# EAGLE design Bus_Isolator (EAGLE 6.5.0)
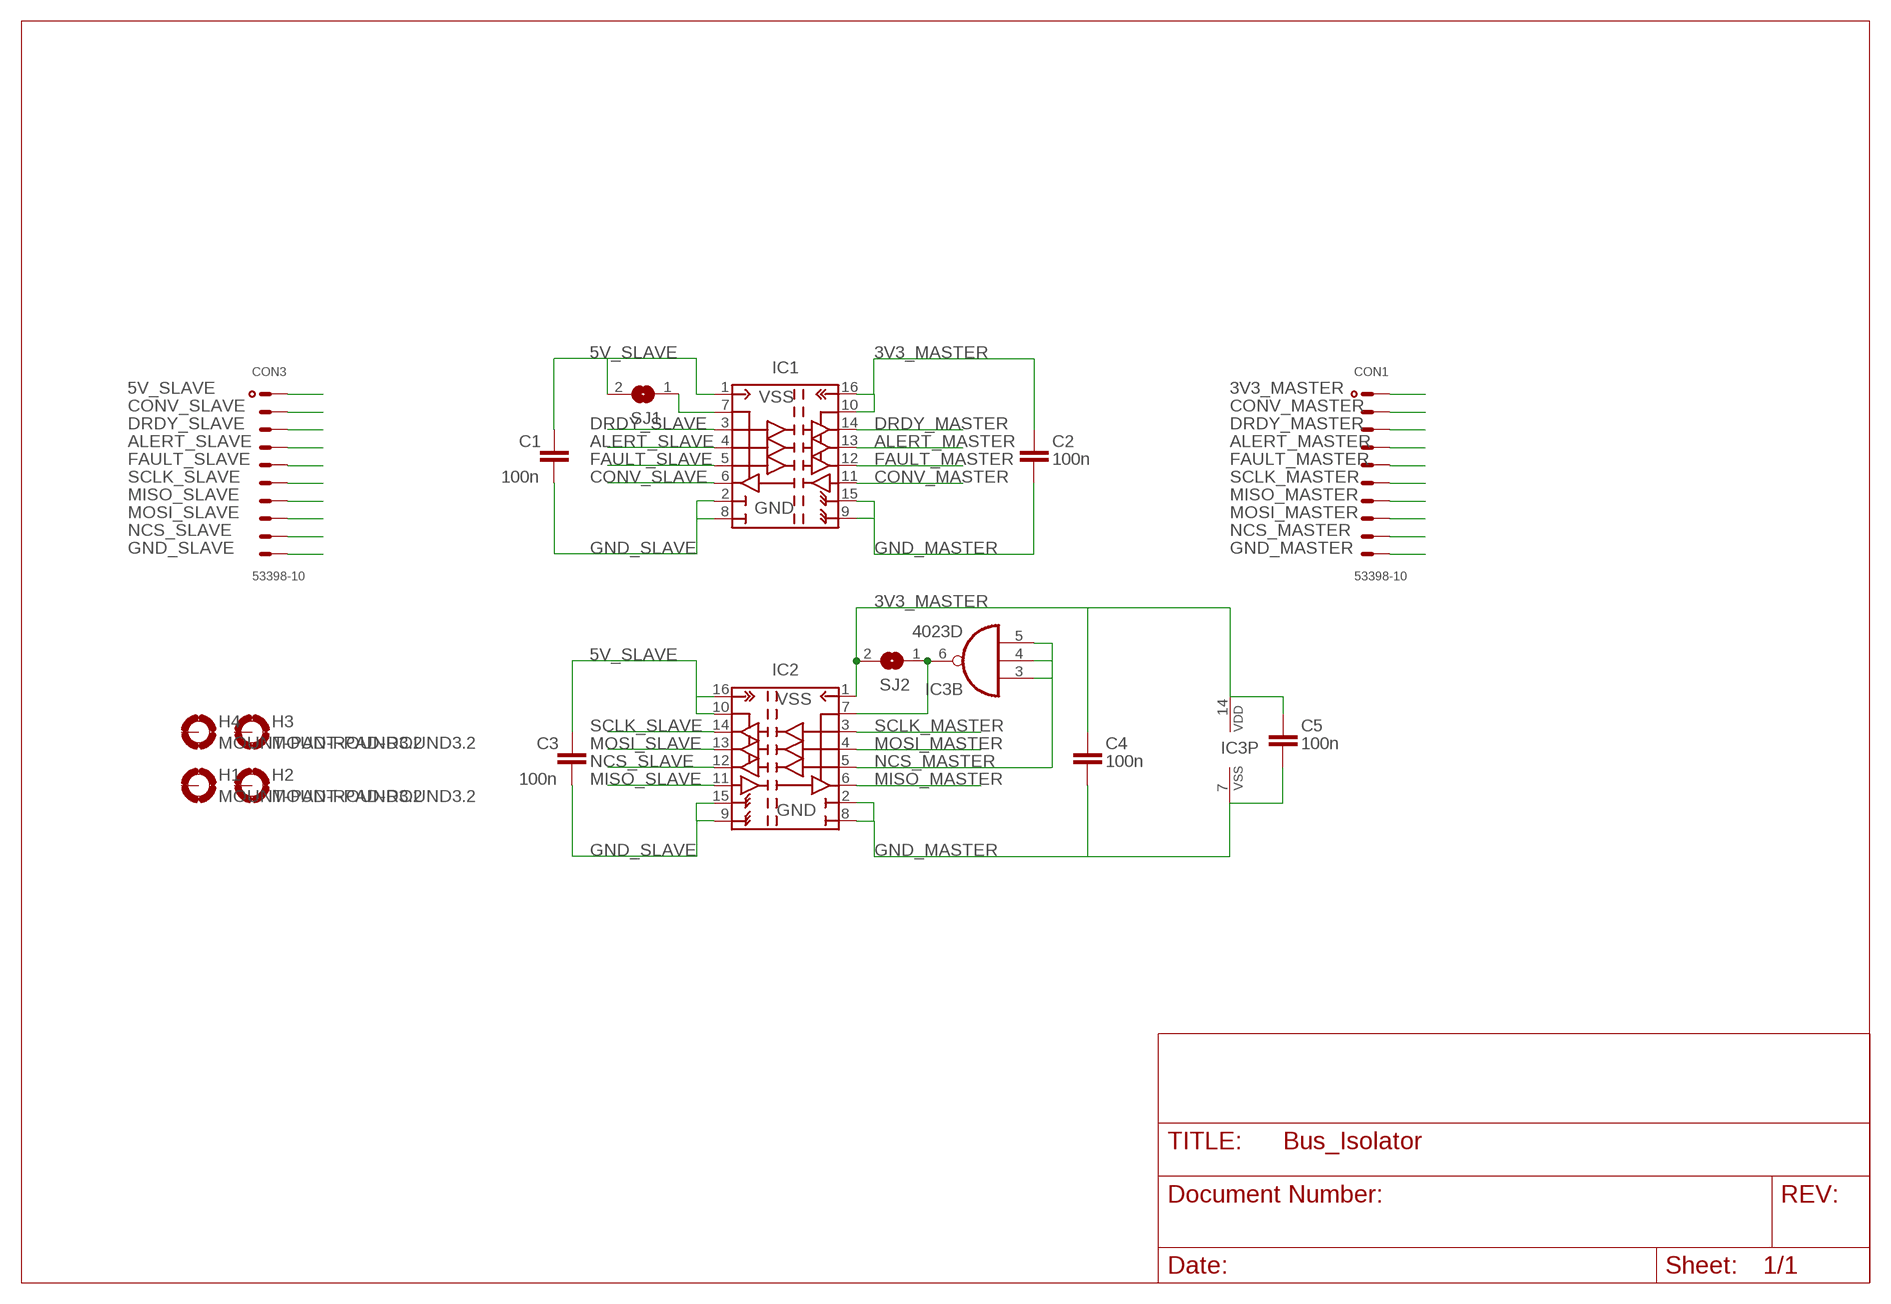
[diagram p0: schematic, sheet 1]

## Parts
C1  100n  CSTD  [C0805]
C2  100n  CSTD  [C0805]
C3  100n  CSTD  [C0805]
C4  100n  CSTD  [C0805]
C5  100n  CSTD  [C0805]
CON1  53398-10  [53398-10]
CON3  53398-10  [53398-10]
H1  MOUNT-PAD-ROUND3.2  [3,2-PAD]
H2  MOUNT-PAD-ROUND3.2  [3,2-PAD]
H3  MOUNT-PAD-ROUND3.2  [3,2-PAD]
H4  MOUNT-PAD-ROUND3.2  [3,2-PAD]
IC1  ISO7241  [R-PDSO-G16]
IC2  ISO7241  [R-PDSO-G16]
IC3  4023D  [SO14]
SJ1  SJ  [SJ]
SJ2  SJ  [SJ]

## Nets
3V3_MASTER: C2.2 C4.2 C5.2 CON1.1 IC1.10(EN2) IC1.16(VCC2) IC2.1(VCC1) IC3.14(P:VDD) SJ2.2
5V_SLAVE: C1.2 C3.2 CON3.1 IC1.1(VCC1) IC2.10(EN2) IC2.16(VCC2) SJ1.2
ALERT_MASTER: CON1.4 IC1.13(OUT_B)
ALERT_SLAVE: CON3.4 IC1.4(IN_B)
CONV_MASTER: CON1.2 IC1.11(IN_D)
CONV_SLAVE: CON3.2 IC1.6(OUT_D)
DRDY_MASTER: CON1.3 IC1.14(OUT_A)
DRDY_SLAVE: CON3.3 IC1.3(IN_A)
FAULT_MASTER: CON1.5 IC1.12(OUT_C)
FAULT_SLAVE: CON3.5 IC1.5(IN_C)
GND_MASTER: C2.1 C4.1 C5.1 CON1.10 IC1.9(GND22) IC1.15(GND21) IC2.2(GND11) IC2.8(GND12) IC3.7(P:VSS)
GND_SLAVE: C1.1 C3.1 CON3.10 IC1.2(GND11) IC1.8(GND12) IC2.9(GND22) IC2.15(GND21)
MISO_MASTER: CON1.7 IC2.6(OUT_D)
MISO_SLAVE: CON3.7 IC2.11(IN_D)
MOSI_MASTER: CON1.8 IC2.4(IN_B)
MOSI_SLAVE: CON3.8 IC2.13(OUT_B)
N$1: IC1.7(EN1) SJ1.1
N$2: IC2.7(EN1) IC3.6(B:O) SJ2.1
NCS_MASTER: CON1.9 IC2.5(IN_C) IC3.3(B:I0) IC3.4(B:I1) IC3.5(B:I2)
NCS_SLAVE: CON3.9 IC2.12(OUT_C)
SCLK_MASTER: CON1.6 IC2.3(IN_A)
SCLK_SLAVE: CON3.6 IC2.14(OUT_A)
Unconnected: H1.B3,2(MOUNT) H2.B3,2(MOUNT) H3.B3,2(MOUNT) H4.B3,2(MOUNT) IC3.1(A:I0) IC3.2(A:I1) IC3.8(A:I2) IC3.9(A:O) IC3.10(C:O) IC3.11(C:I0) IC3.12(C:I1) IC3.13(C:I2)

## Library data of the parts
C1-C5 = useful:C
CON1 CON3 = con-molex:53?-10: CONNECTOR wire to board 1.25 mm (.049 inch) pitch header
H1-H4 = holes:MOUNT-PAD-ROUND: MOUNTING PAD, round
IC1 IC2 = ti:ISO7241
IC3 = 40xx:4023: Triple 3-input NAND
SJ1 SJ2 = jumper:SJ: SMD solder JUMPER

## Board
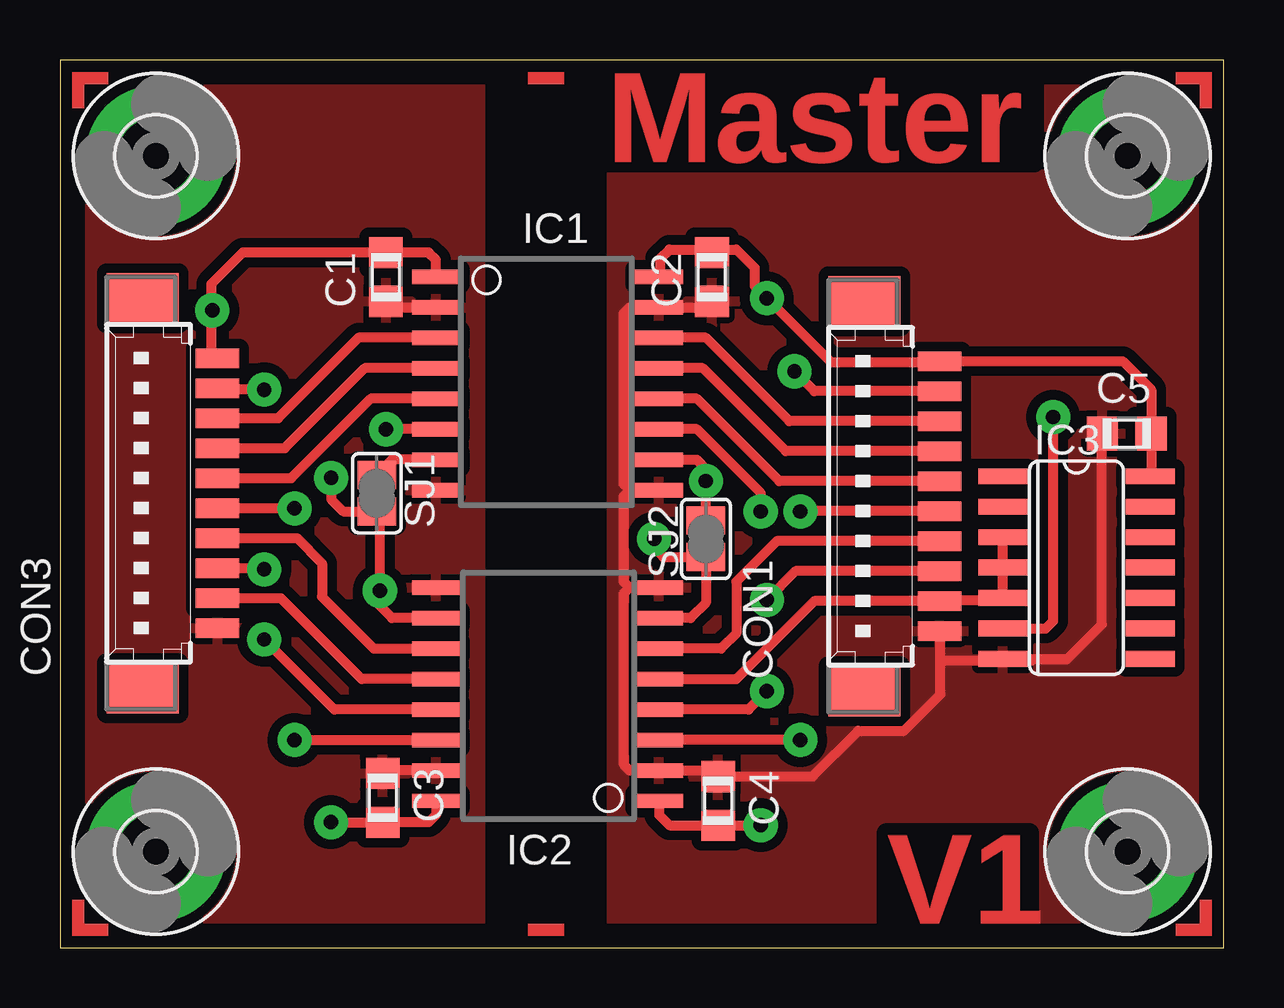
[diagram p1: board, top side]
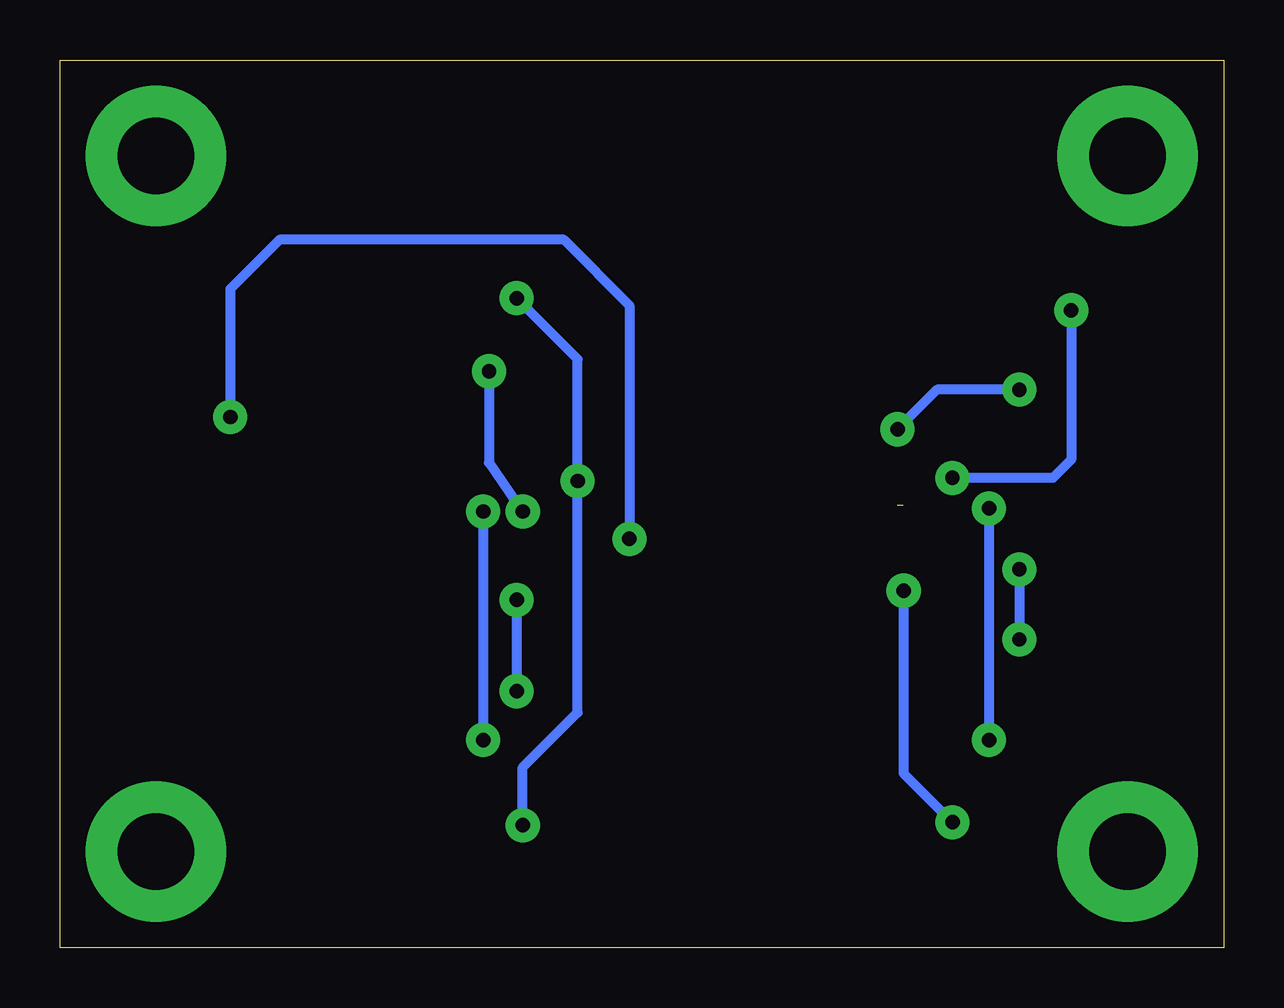
[diagram p2: board, bottom side, seen from below]

Size 48.5 x 37 mm. Coordinates in mm from the lower left corner, seen from the top.
Outline: 0,0 48.5,0 48.5,37 0,37 0,0
Copper layers (1*16): Top 0.035mm / dielectric 1.5mm / Bottom 0.035mm
Design rules "default": minimum track width 10mil, minimum drill 24mil, track to track 8mil, track to pad 8mil, pad to pad 8mil, via to via 8mil, smd to smd 8mil, copper to edge 40mil, drill to drill 8mil, minimum pad ring 10mil, minimum via ring 8mil, stop-mask expansion 4mil, vias tented up to drill 0mil, thermal gap 10mil

### Footprints (pad centres in the part's own frame; a part is rotated, then mirrored left to right if it is on the bottom)
C0805 = smd 1.3 x 1.4: 1 -1.016,0; 2 1.016,0
53398-10 = smd 0.8 x 1.8: 1 5.625,-2.5; 2 4.375,-2.5; 3 3.125,-2.5; 4 1.875,-2.5; 5 0.625,-2.5; 6 -0.625,-2.5; 7 -1.875,-2.5; 8 -3.125,-2.5; 9 -4.375,-2.5; 10 -5.625,-2.5 | smd 2.1 x 3: S1 8.125,0.625; S2 -8.125,0.625
3,2-PAD = drill 3.2 pad 5.842: B3,2 0,0
R-PDSO-G16 = smd 0.6 x 2: 1 -3.937,-4.649; 2 -2.667,-4.649; 3 -1.397,-4.649; 4 -0.127,-4.649; 5 1.143,-4.649; 6 2.413,-4.649; 7 3.683,-4.649; 8 4.953,-4.649; 9 4.953,4.651; 10 3.683,4.651; 11 2.413,4.651; 12 1.143,4.651; 13 -0.127,4.651; 14 -1.397,4.651; 15 -2.667,4.651; 16 -3.937,4.651
SO14 = smd 0.66 x 2.032: 1 -3.81,-3.073; 2 -2.54,-3.073; 3 -1.27,-3.073; 4 0,-3.073; 5 1.27,-3.073; 6 2.54,-3.073; 7 3.81,-3.073; 8 3.81,3.073; 9 2.54,3.073; 10 1.27,3.073; 11 0,3.073; 12 -1.27,3.073; 13 -2.54,3.073; 14 -3.81,3.073
SJ = smd 1.168 x 1.6: 1 -0.762,0; 2 0.762,0

### Placement (x,y rotation side)
C1  13.59,27.96 90 top
C2  27.18,27.96 90 top
C3  13.45,6.24 270 top
C4  27.43,6.11 270 top
C5  44.47,21.43 0 top
CON1  34.16,18.81 90 top
CON3  4.06,18.94 90 top
H1  4,4 0 top
H2  44.5,4 0 top
H3  4,33 0 top
H4  44.5,33 0 top
IC1  20.32,24.02 270 top
IC2  20.32,10.05 90 top
IC3  42.37,15.84 270 top
SJ1  13.21,18.94 270 top
SJ2  26.92,17.04 90 top

### Tracks (layer width: path | path; a pad name or v marks a point on that pad's centre or on a via)
3V3_MASTER  (via drill 0.6 pad 1.42)
  Top 0.406: 27.56,29.1 25.4,29.1 25.02,28.72 25.02,28 IC1.16 | 27.56,29.1 C2.2 | 27.56,29.1 28.19,29.1 28.96,28.34 28.96,27.58 v29.46,27.07 32.13,24.4 35.99,24.4 CON1.1 44.3,24.44 45.48,23.26 C5.2 45.48,19.88 IC3.14 | SJ2.2 v26.92,19.45 26.92,19.96 26.54,20.34 IC1.10 | IC2.1 24.97,5.53 25.4,5.1 C4.2 v29.21,5.1
  Bottom 0.406: v29.46,27.07 26.92,24.53 v26.92,19.45 26.92,9.8 29.21,7.51 v29.21,5.1
5V_SLAVE  (via drill 0.6 pad 1.42)  (1 unrouted)
  Top 0.406: 13.59,18.43 SJ1.2 11.81,18.18 11.3,18.69 v11.3,19.57 | 13.34,18.43 v13.34,14.88 13.34,14.24 13.84,13.73 IC2.10 | v11.29,5.22 C3.2 15.37,5.22 15.67,5.53 IC2.16 | IC1.1 15.67,28.67 15.37,28.97 C1.2 7.62,28.97 6.31,27.66 6.31,26.6 v6.35,26.56 6.31,26.52 6.31,24.82 CON3.1
  Bottom 0.406: v6.35,26.56 6.35,20.34 7.11,19.57 v11.3,19.57 | v13.34,14.88 13.34,7.26 v11.29,5.22
ALERT_MASTER
  Top 0.406: CON1.4 30.26,20.69 26.8,24.15 IC1.13
ALERT_SLAVE
  Top 0.406: CON3.4 9.37,20.81 12.7,24.15 IC1.4
CONV_MASTER  (via drill 0.6 pad 1.42)
  Top 0.406: CON1.2 31.45,23.19 v30.61,24.02 | v29.21,18.18 29.21,18.94 26.54,21.61 IC1.11
  Bottom 0.406: v30.61,24.02 30.61,20.22 v29.21,18.18
CONV_SLAVE  (via drill 0.6 pad 1.42)
  Top 0.406: v8.51,23.26 6.37,23.26 CON3.2 | IC1.6 v13.59,21.61
  Bottom 0.406: v8.51,23.26 11.94,23.26 v13.59,21.61
DRDY_MASTER
  Top 0.406: CON1.3 30.4,21.94 26.92,25.42 IC1.14
DRDY_SLAVE
  Top 0.406: CON3.3 9.09,22.06 12.45,25.42 IC1.3
FAULT_MASTER
  Top 0.406: CON1.5 29.98,19.44 26.54,22.88 IC1.12
FAULT_SLAVE
  Top 0.406: CON3.5 9.64,19.56 12.95,22.88 IC1.5
GND_MASTER
  Top 0.406: C2.1 26.92,26.69 IC1.15 23.75,26.69 23.5,26.43 23.5,19.32 23.75,19.07 | IC1.9 23.75,19.07 | 23.75,19.07 23.5,18.81 23.5,15.26 23.75,15 | IC2.8 23.75,15 | 23.75,15 23.5,14.75 23.5,7.64 23.75,7.38 IC2.2 27.18,7.38 C4.1 31.37,7.13 33.27,9.03 35.18,9.03 36.7,10.56 36.7,12.08 | 36.7,12.08 36.7,13.15 CON1.10 | 36.7,12.08 36.83,11.96 40.49,11.96 IC3.7 41.98,12.03 43.43,13.48 43.43,21.41 C5.1
  pour Top (isolate 0.406): 23,37.5 43.5,37.5 49.5,31.5 49.5,4.5 44.5,-0.5 23,-0.5
GND_SLAVE
  Top 0.406: IC1.2 13.84,26.69 C1.1 | IC2.15 13.58,7.38 C3.1
  pour Top (isolate 0.406): 4,37 17.5,37 17.5,-0.5 4.5,-0.5 -0.5,4 -0.5,32.5
MISO_MASTER
  Top 0.406: CON1.7 29.88,16.94 28.19,15.26 28.19,13.1 27.56,12.46 IC2.6
MISO_SLAVE
  Top 0.406: IC2.11 13.08,12.46 10.92,14.62 10.92,16.02 9.88,17.06 CON3.7
MOSI_MASTER  (via drill 0.6 pad 1.42)
  Top 0.406: CON1.8 30.66,15.69 v29.46,14.49 | v29.46,10.68 28.7,9.92 IC2.4
  Bottom 0.406: v29.46,14.49 v29.46,10.68
MOSI_SLAVE  (via drill 0.6 pad 1.42)
  Top 0.406: CON3.8 8.46,15.81 v8.51,15.76 | IC2.13 11.43,9.92 v8.51,12.84
  Bottom 0.406: v8.51,15.76 v8.51,12.84
N$1
  Top 0.406: IC1.7 13.84,20.34 SJ1.1
N$2  (via drill 0.6 pad 1.42)
  Top 0.406: IC2.7 26.29,13.73 26.92,14.37 SJ2.1 25.15,16.27 24.77,16.65 v24.77,17.04 | IC3.6 41.09,13.3 41.4,13.61 v41.4,22.11
  Bottom 0.406: v24.77,17.04 24.77,26.77 27.5,29.5 39.35,29.5 41.4,27.45 v41.4,22.11
NCS_MASTER
  Top 0.406: IC2.5 28.19,11.19 31.44,14.44 CON1.9 36.72,14.49 39.1,14.49 IC3.5 IC3.4 IC3.3
NCS_SLAVE
  Top 0.406: IC2.12 12.57,11.19 9.2,14.56 CON3.9
SCLK_MASTER  (via drill 0.6 pad 1.42)
  Top 0.406: CON1.6 v30.87,18.19 v30.86,18.18 | v30.86,8.65 IC2.3
  Bottom 0.406: v30.86,18.18 v30.86,8.65
SCLK_SLAVE  (via drill 0.6 pad 1.42)
  Top 0.406: CON3.6 9.52,18.31 v9.78,18.3 | v9.78,8.65 IC2.14
  Bottom 0.406: v9.78,18.3 v9.78,8.65
(copper drawn outside any net)
  shapes: Top area x10

### Text on the board
Top: Master | V1